# EAGLE schematic TVM802B Testboard (EAGLE 6.4)
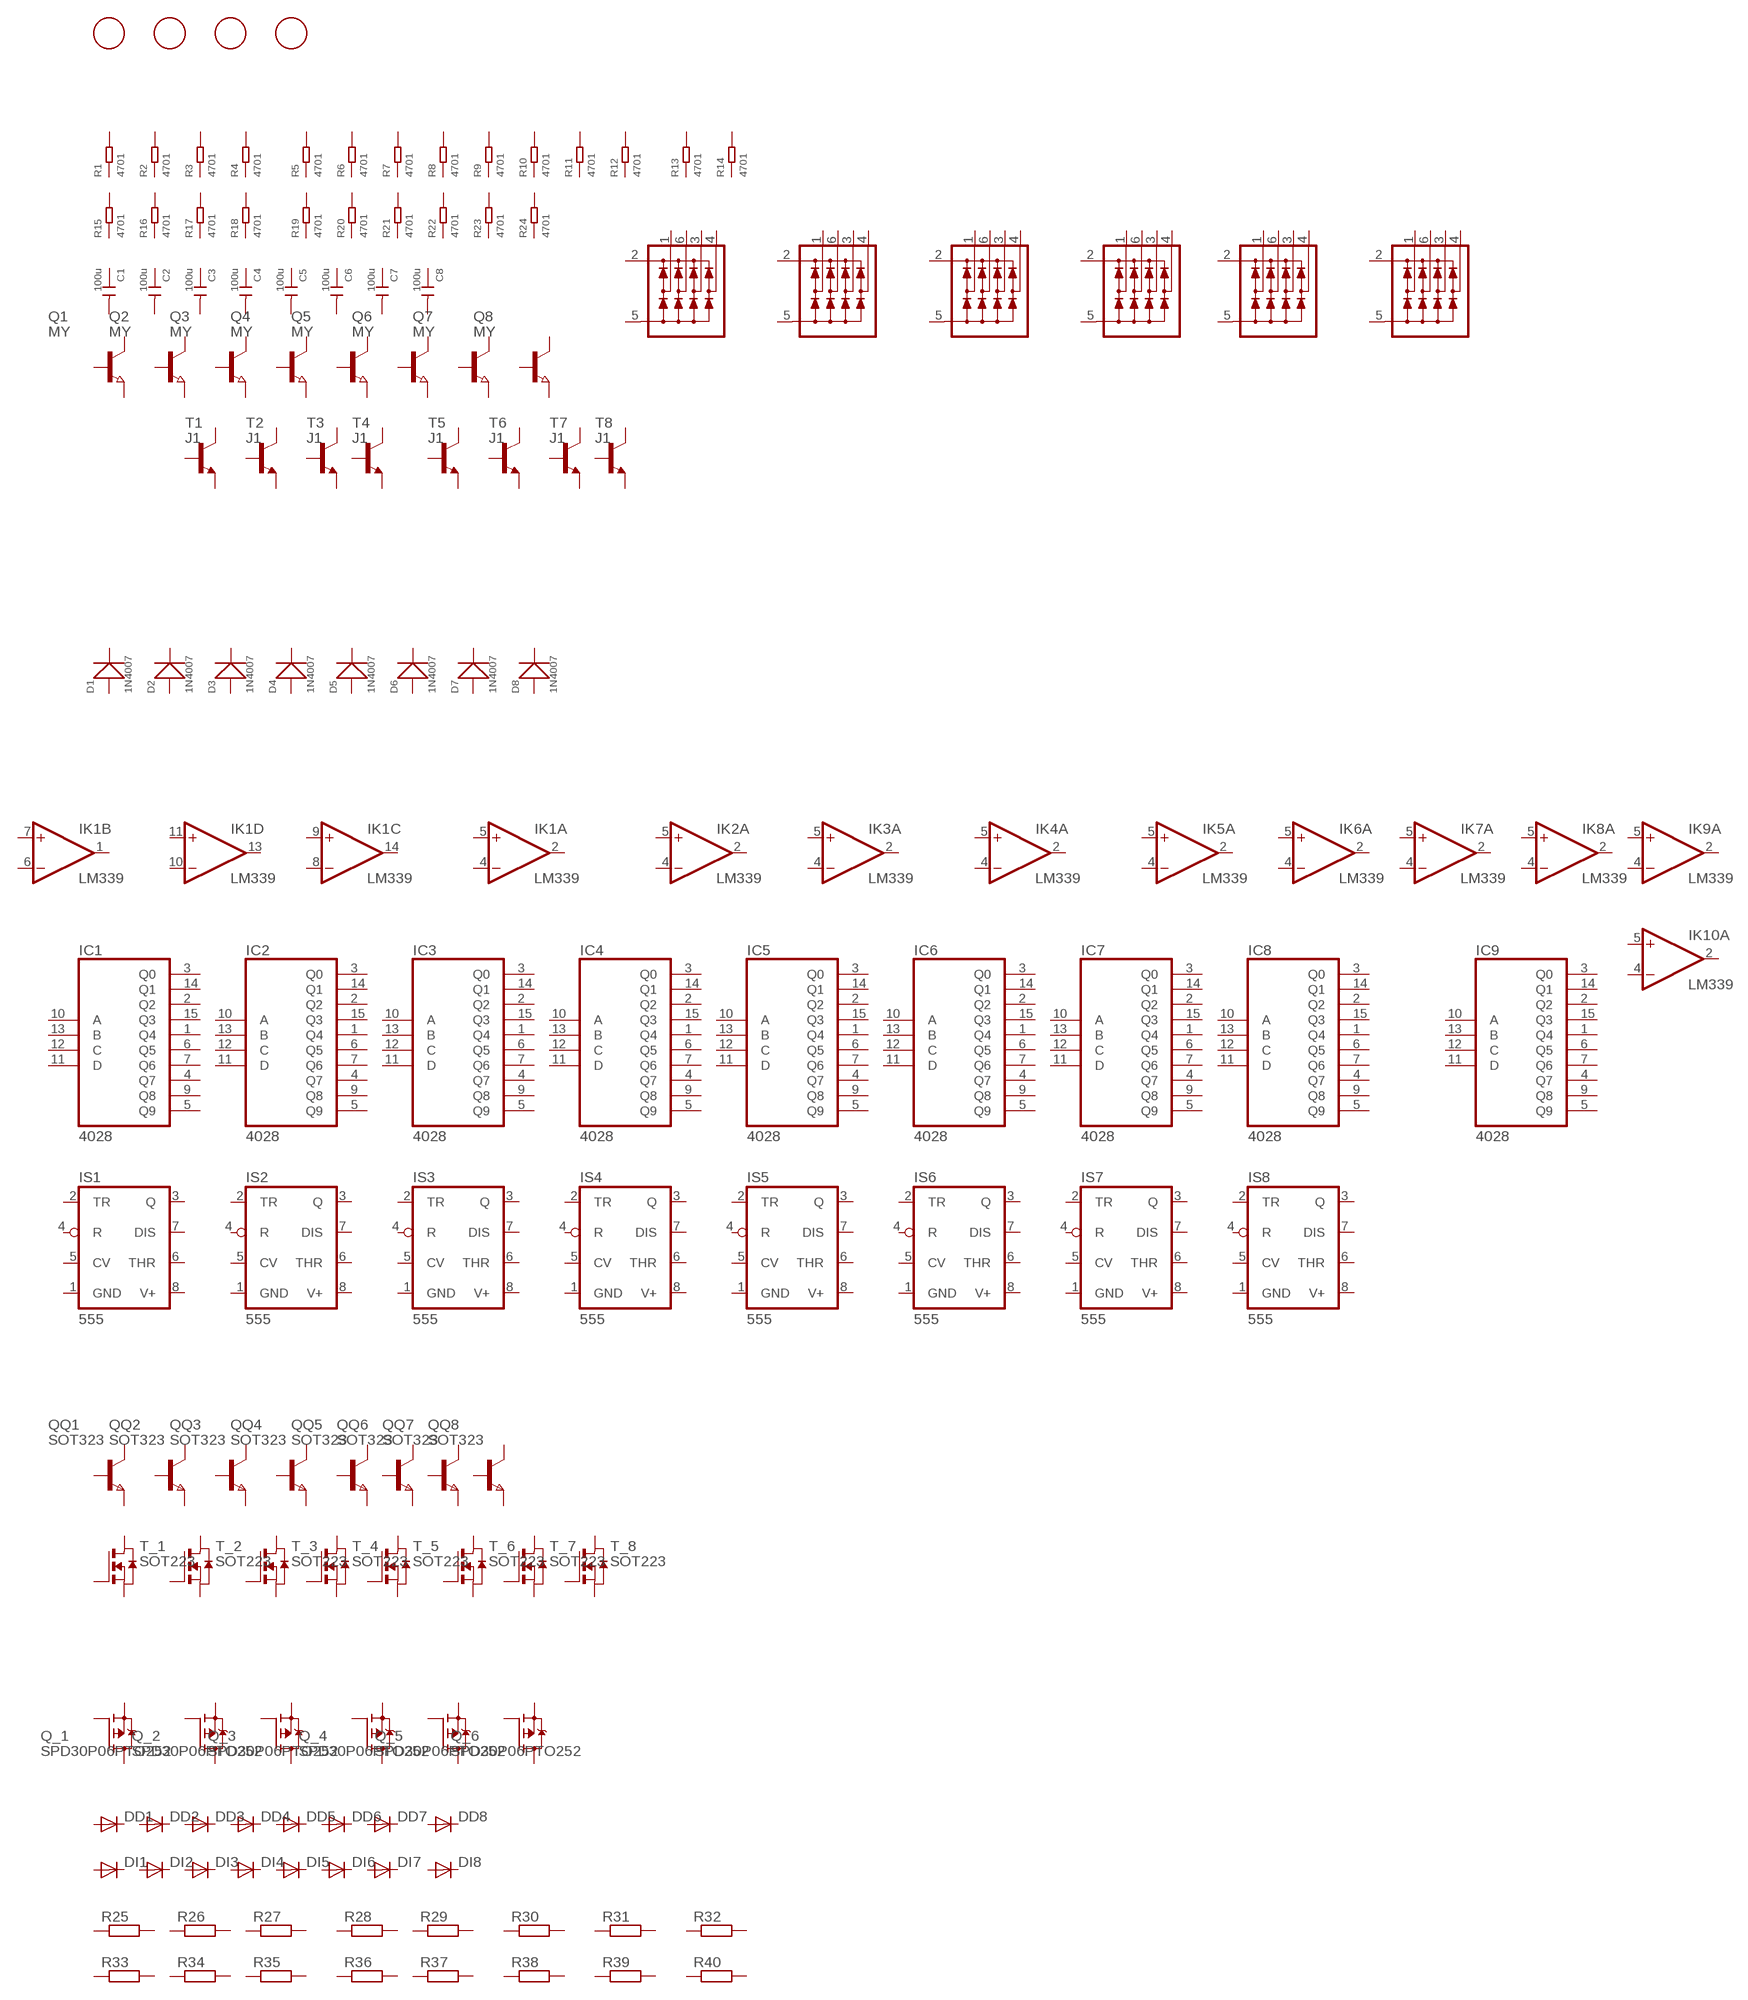
[diagram p0: schematic, sheet 1]

## Parts
C1  100u  CERAMIC-100UF-6.3V-20%-X5R(1206)  [C1206]
C2  100u  CERAMIC-100UF-6.3V-20%-X5R(1206)  [C1206]
C3  100u  CERAMIC-100UF-6.3V-20%-X5R(1206)  [C1206]
C4  100u  CERAMIC-100UF-6.3V-20%-X5R(1206)  [C1206]
C5  100u  CERAMIC-100UF-6.3V-20%-X5R(1206)  [C1206]
C6  100u  CERAMIC-100UF-6.3V-20%-X5R(1206)  [C1206]
C7  100u  CERAMIC-100UF-6.3V-20%-X5R(1206)  [C1206]
C8  100u  CERAMIC-100UF-6.3V-20%-X5R(1206)  [C1206]
D1  1N4007  DIODE-GEN-PURPOSE-1KV-1A(DO-214AC)  [DO-214AC]
D2  1N4007  DIODE-GEN-PURPOSE-1KV-1A(DO-214AC)  [DO-214AC]
D3  1N4007  DIODE-GEN-PURPOSE-1KV-1A(DO-214AC)  [DO-214AC]
D4  1N4007  DIODE-GEN-PURPOSE-1KV-1A(DO-214AC)  [DO-214AC]
D5  1N4007  DIODE-GEN-PURPOSE-1KV-1A(DO-214AC)  [DO-214AC]
D6  1N4007  DIODE-GEN-PURPOSE-1KV-1A(DO-214AC)  [DO-214AC]
D7  1N4007  DIODE-GEN-PURPOSE-1KV-1A(DO-214AC)  [DO-214AC]
D8  1N4007  DIODE-GEN-PURPOSE-1KV-1A(DO-214AC)  [DO-214AC]
DD1  DIODE-SOD123  [SOD123]
DD2  DIODE-SOD123  [SOD123]
DD3  DIODE-SOD123  [SOD123]
DD4  DIODE-SOD123  [SOD123]
DD5  DIODE-SOD123  [SOD123]
DD6  DIODE-SOD123  [SOD123]
DD7  DIODE-SOD123  [SOD123]
DD8  DIODE-SOD123  [SOD123]
DI1  DIODE-SOD323-R  [SOD323-R]
DI2  DIODE-SOD323-R  [SOD323-R]
DI3  DIODE-SOD323-R  [SOD323-R]
DI4  DIODE-SOD323-R  [SOD323-R]
DI5  DIODE-SOD323-R  [SOD323-R]
DI6  DIODE-SOD323-R  [SOD323-R]
DI7  DIODE-SOD323-R  [SOD323-R]
DI8  DIODE-SOD323-R  [SOD323-R]
FID1_  FID2  FIDUCIAL  [FIDUCIAL_1MM]
FID2  FID1  FIDUCIAL  [FIDUCIAL_1MM]
FID3_  FIDUCIAL  [FIDUCIAL_1MM]
FID4  FIDUCIAL  [FIDUCIAL_1MM]
IC1  4028  4028D  [SO16]
IC2  4028  4028D  [SO16]
IC3  4028  4028D  [SO16]
IC4  4028  4028D  [SO16]
IC5  4028  4028D  [SO16]
IC6  4028  4028D  [SO16]
IC7  4028  4028D  [SO16]
IC8  4028  4028D  [SO16]
IC9  4028  4028D  [SO16]
IK1  LM339  LM339D  [SO14]
IK2  LM339  LM339D  [SO14]
IK3  LM339  LM339D  [SO14]
IK4  LM339  LM339D  [SO14]
IK5  LM339  LM339D  [SO14]
IK6  LM339  LM339D  [SO14]
IK7  LM339  LM339D  [SO14]
IK8  LM339  LM339D  [SO14]
IK9  LM339  LM339D  [SO14]
IK10  LM339  LM339D  [SO14]
IS1  555  NE555D  [SO08]
IS2  555  NE555D  [SO08]
IS3  555  NE555D  [SO08]
IS4  555  NE555D  [SO08]
IS5  555  NE555D  [SO08]
IS6  555  NE555D  [SO08]
IS7  555  NE555D  [SO08]
IS8  555  NE555D  [SO08]
Q1  MY  NPN-TRANSISTOR_SOT89  [SOT89]
Q2  MY  NPN-TRANSISTOR_SOT89  [SOT89]
Q3  MY  NPN-TRANSISTOR_SOT89  [SOT89]
Q4  MY  NPN-TRANSISTOR_SOT89  [SOT89]
Q5  MY  NPN-TRANSISTOR_SOT89  [SOT89]
Q6  MY  NPN-TRANSISTOR_SOT89  [SOT89]
Q7  MY  NPN-TRANSISTOR_SOT89  [SOT89]
Q8  MY  NPN-TRANSISTOR_SOT89  [SOT89]
Q_1  SPD30P06PTO252  [TO252]
Q_2  SPD30P06PTO252  [TO252]
Q_3  SPD30P06PTO252  [TO252]
Q_4  SPD30P06PTO252  [TO252]
Q_5  SPD30P06PTO252  [TO252]
Q_6  SPD30P06PTO252  [TO252]
QQ1  SOT323  NPNSOT323  [SOT323]
QQ2  SOT323  NPNSOT323  [SOT323]
QQ3  SOT323  NPNSOT323  [SOT323]
QQ4  SOT323  NPNSOT323  [SOT323]
QQ5  SOT323  NPNSOT323  [SOT323]
QQ6  SOT323  NPNSOT323  [SOT323]
QQ7  SOT323  NPNSOT323  [SOT323]
QQ8  SOT323  NPNSOT323  [SOT323]
R1  4701  SMD-RES-4.7K-5%-1/8W(0805)  [R0805]
R2  4701  SMD-RES-4.7K-5%-1/8W(0805)  [R0805]
R3  4701  SMD-RES-4.7K-5%-1/8W(0805)  [R0805]
R4  4701  SMD-RES-4.7K-5%-1/8W(0805)  [R0805]
R5  4701  SMD-RES-4.7K-5%-1/8W(0805)  [R0805]
R6  4701  SMD-RES-4.7K-5%-1/8W(0805)  [R0805]
R7  4701  SMD-RES-4.7K-5%-1/8W(0805)  [R0805]
R8  4701  SMD-RES-4.7K-5%-1/8W(0805)  [R0805]
R9  4701  SMD-RES-4.7K-5%-1/8W(0805)  [R0805]
R10  4701  SMD-RES-4.7K-5%-1/8W(0805)  [R0805]
R11  4701  SMD-RES-4.7K-5%-1/8W(0805)  [R0805]
R12  4701  SMD-RES-4.7K-5%-1/8W(0805)  [R0805]
R13  4701  SMD-RES-4.7K-5%-1/8W(0805)  [R0805]
R14  4701  SMD-RES-4.7K-5%-1/8W(0805)  [R0805]
R15  4701  SMD-RES-4.7K-5%-1/8W(0805)  [R0805]
R16  4701  SMD-RES-4.7K-5%-1/8W(0805)  [R0805]
R17  4701  SMD-RES-4.7K-5%-1/8W(0805)  [R0805]
R18  4701  SMD-RES-4.7K-5%-1/8W(0805)  [R0805]
R19  4701  SMD-RES-4.7K-5%-1/8W(0805)  [R0805]
R20  4701  SMD-RES-4.7K-5%-1/8W(0805)  [R0805]
R21  4701  SMD-RES-4.7K-5%-1/8W(0805)  [R0805]
R22  4701  SMD-RES-4.7K-5%-1/8W(0805)  [R0805]
R23  4701  SMD-RES-4.7K-5%-1/8W(0805)  [R0805]
R24  4701  SMD-RES-4.7K-5%-1/8W(0805)  [R0805]
R25  R-EU_R0603  [R0603]
R26  R-EU_R0603  [R0603]
R27  R-EU_R0603  [R0603]
R28  R-EU_R0603  [R0603]
R29  R-EU_R0603  [R0603]
R30  R-EU_R0603  [R0603]
R31  R-EU_R0603  [R0603]
R32  R-EU_R0603  [R0603]
R33  R-EU_R0402  [R0402]
R34  R-EU_R0402  [R0402]
R35  R-EU_R0402  [R0402]
R36  R-EU_R0402  [R0402]
R37  R-EU_R0402  [R0402]
R38  R-EU_R0402  [R0402]
R39  R-EU_R0402  [R0402]
R40  R-EU_R0402  [R0402]
T1  J1  MMBTA42LT1-NPN-SOT23-BEC  [SOT23-BEC]
T2  J1  MMBTA42LT1-NPN-SOT23-BEC  [SOT23-BEC]
T3  J1  MMBTA42LT1-NPN-SOT23-BEC  [SOT23-BEC]
T4  J1  MMBTA42LT1-NPN-SOT23-BEC  [SOT23-BEC]
T5  J1  MMBTA42LT1-NPN-SOT23-BEC  [SOT23-BEC]
T6  J1  MMBTA42LT1-NPN-SOT23-BEC  [SOT23-BEC]
T7  J1  MMBTA42LT1-NPN-SOT23-BEC  [SOT23-BEC]
T8  J1  MMBTA42LT1-NPN-SOT23-BEC  [SOT23-BEC]
T_1  SOT223  NMOSSOT223  [SOT223]
T_2  SOT223  NMOSSOT223  [SOT223]
T_3  SOT223  NMOSSOT223  [SOT223]
T_4  SOT223  NMOSSOT223  [SOT223]
T_5  SOT223  NMOSSOT223  [SOT223]
T_6  SOT223  NMOSSOT223  [SOT223]
T_7  SOT223  NMOSSOT223  [SOT223]
T_8  SOT223  NMOSSOT223  [SOT223]
U1  NUP4304SOT457_R  [SOT457R_PHILIPS]
U2  NUP4304SOT457_R  [SOT457R_PHILIPS]
U3  NUP4304SOT457_R  [SOT457R_PHILIPS]
U4  NUP4304SOT457_R  [SOT457R_PHILIPS]
U5  NUP4304SOT457_R  [SOT457R_PHILIPS]
U6  NUP4304SOT457_R  [SOT457R_PHILIPS]
Unconnected: C1.1 C1.2 C2.1 C2.2 C3.1 C3.2 C4.1 C4.2 C5.1 C5.2 C6.1 C6.2 C7.1 C7.2 C8.1 C8.2 D1.1(+) D1.2(-) D2.1(+) D2.2(-) D3.1(+) D3.2(-) D4.1(+) D4.2(-) D5.1(+) D5.2(-) D6.1(+) D6.2(-) D7.1(+) D7.2(-) D8.1(+) D8.2(-) DD1.A DD1.C DD2.A DD2.C DD3.A DD3.C DD4.A DD4.C DD5.A DD5.C DD6.A DD6.C DD7.A DD7.C DD8.A DD8.C DI1.A DI1.C DI2.A DI2.C DI3.A DI3.C DI4.A DI4.C DI5.A DI5.C DI6.A DI6.C DI7.A DI7.C DI8.A DI8.C IC1.1(Q4) IC1.2(Q2) IC1.3(Q0) IC1.4(Q7) IC1.5(Q9) IC1.6(Q5) IC1.7(Q6) IC1.9(Q8) IC1.10(A) IC1.11(D) IC1.12(C) IC1.13(B) IC1.14(Q1) IC1.15(Q3) IC2.1(Q4) IC2.2(Q2) IC2.3(Q0) IC2.4(Q7) IC2.5(Q9) IC2.6(Q5) IC2.7(Q6) IC2.9(Q8) IC2.10(A) IC2.11(D) IC2.12(C) IC2.13(B) IC2.14(Q1) IC2.15(Q3) IC3.1(Q4) IC3.2(Q2) IC3.3(Q0) IC3.4(Q7) IC3.5(Q9) IC3.6(Q5) IC3.7(Q6) IC3.9(Q8) IC3.10(A) IC3.11(D) IC3.12(C) IC3.13(B) IC3.14(Q1) IC3.15(Q3) IC4.1(Q4) IC4.2(Q2) IC4.3(Q0) IC4.4(Q7) IC4.5(Q9) IC4.6(Q5) IC4.7(Q6) IC4.9(Q8) IC4.10(A) IC4.11(D) IC4.12(C) IC4.13(B) IC4.14(Q1) IC4.15(Q3) IC5.1(Q4) IC5.2(Q2) IC5.3(Q0) IC5.4(Q7) IC5.5(Q9) IC5.6(Q5) IC5.7(Q6) IC5.9(Q8) IC5.10(A) IC5.11(D) IC5.12(C) IC5.13(B) IC5.14(Q1) IC5.15(Q3) IC6.1(Q4) IC6.2(Q2) IC6.3(Q0) IC6.4(Q7) IC6.5(Q9) IC6.6(Q5) IC6.7(Q6) IC6.9(Q8) IC6.10(A) IC6.11(D) IC6.12(C) IC6.13(B) IC6.14(Q1) IC6.15(Q3) IC7.1(Q4) IC7.2(Q2) IC7.3(Q0) IC7.4(Q7) IC7.5(Q9) IC7.6(Q5) IC7.7(Q6) IC7.9(Q8) IC7.10(A) IC7.11(D) IC7.12(C) IC7.13(B) IC7.14(Q1) IC7.15(Q3) IC8.1(Q4) IC8.2(Q2) IC8.3(Q0) IC8.4(Q7) IC8.5(Q9) IC8.6(Q5) IC8.7(Q6) IC8.9(Q8) IC8.10(A) IC8.11(D) IC8.12(C) IC8.13(B) IC8.14(Q1) IC8.15(Q3) IC9.1(Q4) IC9.2(Q2) IC9.3(Q0) IC9.4(Q7) IC9.5(Q9) IC9.6(Q5) IC9.7(Q6) IC9.9(Q8) IC9.10(A) IC9.11(D) IC9.12(C) IC9.13(B) IC9.14(Q1) IC9.15(Q3) IK1.1(B:OUT) IK1.2(A:OUT) IK1.4(A:-IN) IK1.5(A:+IN) IK1.6(B:-IN) IK1.7(B:+IN) IK1.8(C:-IN) IK1.9(C:+IN) IK1.10(D:-IN) IK1.11(D:+IN) IK1.13(D:OUT) IK1.14(C:OUT) IK2.1(B:OUT) IK2.2(A:OUT) IK2.4(A:-IN) IK2.5(A:+IN) IK2.6(B:-IN) IK2.7(B:+IN) IK2.8(C:-IN) IK2.9(C:+IN) IK2.10(D:-IN) IK2.11(D:+IN) IK2.13(D:OUT) IK2.14(C:OUT) IK3.1(B:OUT) IK3.2(A:OUT) IK3.4(A:-IN) IK3.5(A:+IN) IK3.6(B:-IN) IK3.7(B:+IN) IK3.8(C:-IN) IK3.9(C:+IN) IK3.10(D:-IN) IK3.11(D:+IN) IK3.13(D:OUT) IK3.14(C:OUT) IK4.1(B:OUT) IK4.2(A:OUT) IK4.4(A:-IN) IK4.5(A:+IN) IK4.6(B:-IN) IK4.7(B:+IN) IK4.8(C:-IN) IK4.9(C:+IN) IK4.10(D:-IN) IK4.11(D:+IN) IK4.13(D:OUT) IK4.14(C:OUT) IK5.1(B:OUT) IK5.2(A:OUT) IK5.4(A:-IN) IK5.5(A:+IN) IK5.6(B:-IN) IK5.7(B:+IN) IK5.8(C:-IN) IK5.9(C:+IN) IK5.10(D:-IN) IK5.11(D:+IN) IK5.13(D:OUT) IK5.14(C:OUT) IK6.1(B:OUT) IK6.2(A:OUT) IK6.4(A:-IN) IK6.5(A:+IN) IK6.6(B:-IN) IK6.7(B:+IN) IK6.8(C:-IN) IK6.9(C:+IN) IK6.10(D:-IN) IK6.11(D:+IN) IK6.13(D:OUT) IK6.14(C:OUT) IK7.1(B:OUT) IK7.2(A:OUT) IK7.4(A:-IN) IK7.5(A:+IN) IK7.6(B:-IN) IK7.7(B:+IN) IK7.8(C:-IN) IK7.9(C:+IN) IK7.10(D:-IN) IK7.11(D:+IN) IK7.13(D:OUT) IK7.14(C:OUT) IK8.1(B:OUT) IK8.2(A:OUT) IK8.4(A:-IN) IK8.5(A:+IN) IK8.6(B:-IN) IK8.7(B:+IN) IK8.8(C:-IN) IK8.9(C:+IN) IK8.10(D:-IN) IK8.11(D:+IN) IK8.13(D:OUT) IK8.14(C:OUT) IK9.1(B:OUT) IK9.2(A:OUT) IK9.4(A:-IN) IK9.5(A:+IN) IK9.6(B:-IN) IK9.7(B:+IN) IK9.8(C:-IN) IK9.9(C:+IN) IK9.10(D:-IN) IK9.11(D:+IN) IK9.13(D:OUT) IK9.14(C:OUT) IK10.1(B:OUT) IK10.2(A:OUT) IK10.4(A:-IN) IK10.5(A:+IN) IK10.6(B:-IN) IK10.7(B:+IN) IK10.8(C:-IN) IK10.9(C:+IN) IK10.10(D:-IN) IK10.11(D:+IN) IK10.13(D:OUT) IK10.14(C:OUT) IS1.2(TR) IS1.3(Q) IS1.4(R) IS1.5(CV) IS1.6(THR) IS1.7(DIS) IS2.2(TR) IS2.3(Q) IS2.4(R) IS2.5(CV) IS2.6(THR) IS2.7(DIS) IS3.2(TR) IS3.3(Q) IS3.4(R) IS3.5(CV) IS3.6(THR) IS3.7(DIS) IS4.2(TR) IS4.3(Q) IS4.4(R) IS4.5(CV) IS4.6(THR) IS4.7(DIS) IS5.2(TR) IS5.3(Q) IS5.4(R) IS5.5(CV) IS5.6(THR) IS5.7(DIS) IS6.2(TR) IS6.3(Q) IS6.4(R) IS6.5(CV) IS6.6(THR) IS6.7(DIS) IS7.2(TR) IS7.3(Q) IS7.4(R) IS7.5(CV) IS7.6(THR) IS7.7(DIS) IS8.2(TR) IS8.3(Q) IS8.4(R) IS8.5(CV) IS8.6(THR) IS8.7(DIS) Q1.1(B) Q1.2(C) Q1.3(E) Q2.1(B) Q2.2(C) Q2.3(E) Q3.1(B) Q3.2(C) Q3.3(E) Q4.1(B) Q4.2(C) Q4.3(E) Q5.1(B) Q5.2(C) Q5.3(E) Q6.1(B) Q6.2(C) Q6.3(E) Q7.1(B) Q7.2(C) Q7.3(E) Q8.1(B) Q8.2(C) Q8.3(E) Q_1.1(G) Q_1.2(S) Q_1.3(D) Q_2.1(G) Q_2.2(S) Q_2.3(D) Q_3.1(G) Q_3.2(S) Q_3.3(D) Q_4.1(G) Q_4.2(S) Q_4.3(D) Q_5.1(G) Q_5.2(S) Q_5.3(D) Q_6.1(G) Q_6.2(S) Q_6.3(D) QQ1.1(C) QQ1.2(B) QQ1.3(E) QQ2.1(C) QQ2.2(B) QQ2.3(E) QQ3.1(C) QQ3.2(B) QQ3.3(E) QQ4.1(C) QQ4.2(B) QQ4.3(E) QQ5.1(C) QQ5.2(B) QQ5.3(E) QQ6.1(C) QQ6.2(B) QQ6.3(E) QQ7.1(C) QQ7.2(B) QQ7.3(E) QQ8.1(C) QQ8.2(B) QQ8.3(E) R1.1 R1.2 R2.1 R2.2 R3.1 R3.2 R4.1 R4.2 R5.1 R5.2 R6.1 R6.2 R7.1 R7.2 R8.1 R8.2 R9.1 R9.2 R10.1 R10.2 R11.1 R11.2 R12.1 R12.2 R13.1 R13.2 R14.1 R14.2 R15.1 R15.2 R16.1 R16.2 R17.1 R17.2 R18.1 R18.2 R19.1 R19.2 R20.1 R20.2 R21.1 R21.2 R22.1 R22.2 R23.1 R23.2 R24.1 R24.2 R25.1 R25.2 R26.1 R26.2 R27.1 R27.2 R28.1 R28.2 R29.1 R29.2 R30.1 R30.2 R31.1 R31.2 R32.1 R32.2 R33.1 R33.2 R34.1 R34.2 R35.1 R35.2 R36.1 R36.2 R37.1 R37.2 R38.1 R38.2 R39.1 R39.2 R40.1 R40.2 T1.B T1.C T1.E T2.B T2.C T2.E T3.B T3.C T3.E T4.B T4.C T4.E T5.B T5.C T5.E T6.B T6.C T6.E T7.B T7.C T7.E T8.B T8.C T8.E T_1.1(G) T_1.2(D) T_1.3(S) T_1.4(D) T_2.1(G) T_2.2(D) T_2.3(S) T_2.4(D) T_3.1(G) T_3.2(D) T_3.3(S) T_3.4(D) T_4.1(G) T_4.2(D) T_4.3(S) T_4.4(D) T_5.1(G) T_5.2(D) T_5.3(S) T_5.4(D) T_6.1(G) T_6.2(D) T_6.3(S) T_6.4(D) T_7.1(G) T_7.2(D) T_7.3(S) T_7.4(D) T_8.1(G) T_8.2(D) T_8.3(S) T_8.4(D) U1.1(D1) U1.2(V+) U1.3(D3) U1.4(D4) U1.5(V-) U1.6(D2) U2.1(D1) U2.2(V+) U2.3(D3) U2.4(D4) U2.5(V-) U2.6(D2) U3.1(D1) U3.2(V+) U3.3(D3) U3.4(D4) U3.5(V-) U3.6(D2) U4.1(D1) U4.2(V+) U4.3(D3) U4.4(D4) U4.5(V-) U4.6(D2) U5.1(D1) U5.2(V+) U5.3(D3) U5.4(D4) U5.5(V-) U5.6(D2) U6.1(D1) U6.2(V+) U6.3(D3) U6.4(D4) U6.5(V-) U6.6(D2)

## Power pins joined to a net without a drawn wire
GND: IK1.12(P:GND) IK2.12(P:GND) IK3.12(P:GND) IK4.12(P:GND) IK5.12(P:GND) IK6.12(P:GND) IK7.12(P:GND) IK8.12(P:GND) IK9.12(P:GND) IK10.12(P:GND) IS1.1(GND) IS2.1(GND) IS3.1(GND) IS4.1(GND) IS5.1(GND) IS6.1(GND) IS7.1(GND) IS8.1(GND)
V+: IK1.3(P:V+) IK2.3(P:V+) IK3.3(P:V+) IK4.3(P:V+) IK5.3(P:V+) IK6.3(P:V+) IK7.3(P:V+) IK8.3(P:V+) IK9.3(P:V+) IK10.3(P:V+) IS1.8(V+) IS2.8(V+) IS3.8(V+) IS4.8(V+) IS5.8(V+) IS6.8(V+) IS7.8(V+) IS8.8(V+)
VDD: IC1.16(VDD) IC2.16(VDD) IC3.16(VDD) IC4.16(VDD) IC5.16(VDD) IC6.16(VDD) IC7.16(VDD) IC8.16(VDD) IC9.16(VDD)
VSS: IC1.8(VSS) IC2.8(VSS) IC3.8(VSS) IC4.8(VSS) IC5.8(VSS) IC6.8(VSS) IC7.8(VSS) IC8.8(VSS) IC9.8(VSS)

## Library data of the parts
C1-C8 = Seeed-Capacitor-2016:CERAMIC-100UF-6.3V-20%-X5R(1206): 302010183; MPN: GRM31CR60J107ME39L; VALUE: 100uf
D1-D8 = Diode-do214ac:DIODE-GEN-PURPOSE-1KV-1A(DO-214AC): 304010013; MPN: 1N4007
DD1-DD8 DI1-DI8 = diode:DIODE-: DIODE
FID1_ FID2 FID3_ FID4 = Fiducial:FIDUCIAL: For use by pick and place machines to calibrate the vision/machine, 1mm By microbuilder.eu
IC1-IC9 = 4028:4028: BCD to decimal DECODER
IK1-IK10 = LM339:LM339: Low Power Low Offset Voltage Quad Comparators with open collector; LM139/LM239/LM339/LM2901/LM3302
IS1-IS8 = linear:*555: TIMER
Q1-Q8 = Transistor_SOT89:NPN-TRANSISTOR_: NPN TRANSISTOR
Q_1-Q_6 = transistor-fet:SPD30P06P: SIPMOS(R) Power-Transistor P-Channel, Enhancement mode Source: http://www.infineon.com/upload/Document/cmc_upload/documents/012/3615/SPD_U30P06P.pdf
QQ1-QQ8 = zetex:NPNSOT323: NPN TRANSISTOR; MPN: DSS4160U-7; OC_FARNELL: 1710696; OC_NEWARK: 25R4558
R1-R24 = Seeed-Resistor-2016:SMD-RES-4.7K-5%-1/8W(0805): 301010306; MPN: RC0805JR-074K7L; VALUE: 4.7K
R25-R40 = rcl:R-EU_: RESISTOR, European symbol
T1-T8 = transistor:*-NPN-: NPN Transistror BF959 corrected 2008.03.06
T_1-T_8 = zetex_nmos_BSP78:NMOSSOT223: MOS FET; OC_FARNELL: unknown; OC_NEWARK: unknown
U1-U6 = NUP4304_ESD_Diode_Array:NUP4304